# Altium schematic sheet CAN.SchDoc
size A4
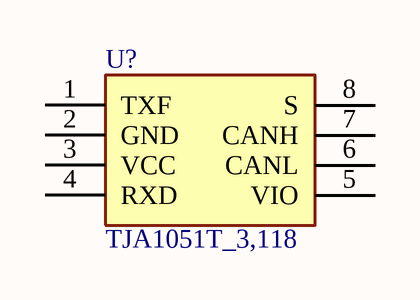
[diagram p0: CAN.SchDoc]

## Parts
U?  TJA1051T_3,118  [TJA1051T/3,118]

## Nets

Not connected (* = marked no-connect by the designer): U? 1(TXF) 2(GND) 3(VCC) 4(RXD) 5(VIO) 6(CANL) 7(CANH) 8(S)

## Library data of the parts
U? = TJA1051T_3,118: CAN Transceiver IC 4.5V-5.5V 250ns; Manufacturer: NXP; Datasheet: http://www.nxp.com/docs/en/data-sheet/TJA1051.pdf; Manufacturer Part Number: TJA1051T/3,118; Supplier Part Number: 568-8684-1-ND; Supplier: Digikey